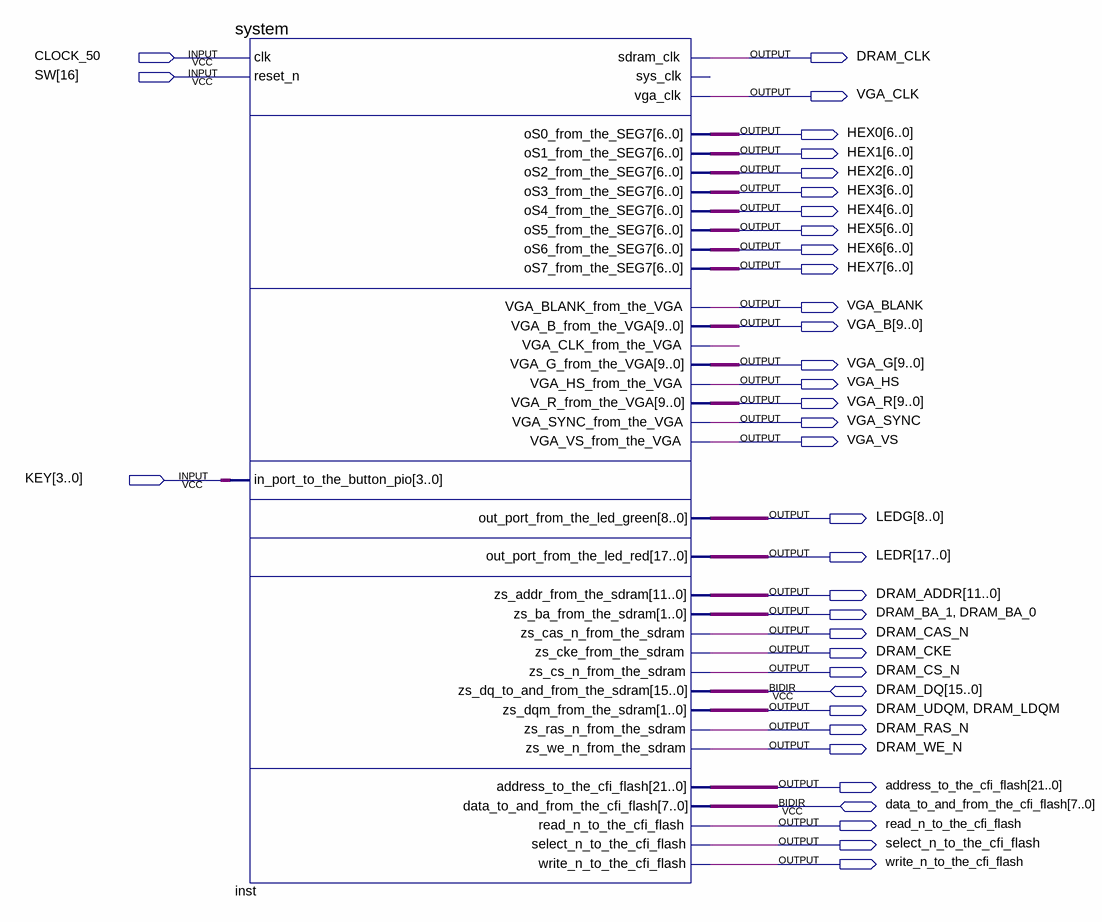
[diagram p0: schematic sheet]
// Quartus schematic example_ref.bdf as structural Verilog: 1 symbols, 36 pins
module example_ref (
  input  CLOCK_50,
  input  [16:16] SW,
  input  [3:0] KEY,
  inout  [15:0] DRAM_DQ,
  inout  [7:0] data_to_and_from_the_cfi_flash,
  output DRAM_CLK,
  output VGA_CLK,
  output [6:0] HEX0,
  output [6:0] HEX1,
  output [6:0] HEX2,
  output [6:0] HEX3,
  output [6:0] HEX4,
  output [6:0] HEX5,
  output [6:0] HEX6,
  output [6:0] HEX7,
  output VGA_BLANK,
  output [9:0] VGA_B,
  output [9:0] VGA_G,
  output VGA_HS,
  output [9:0] VGA_R,
  output VGA_SYNC,
  output VGA_VS,
  output [8:0] LEDG,
  output [17:0] LEDR,
  output [11:0] DRAM_ADDR,
  output DRAM_BA_1,
  output DRAM_BA_0,
  output DRAM_CAS_N,
  output DRAM_CKE,
  output DRAM_CS_N,
  output DRAM_UDQM,
  output DRAM_LDQM,
  output DRAM_RAS_N,
  output DRAM_WE_N,
  output [21:0] address_to_the_cfi_flash,
  output read_n_to_the_cfi_flash,
  output select_n_to_the_cfi_flash,
  output write_n_to_the_cfi_flash
);

  wire inst_vga_clk_from_the_vga;

  system inst (
    .clk(CLOCK_50), .reset_n(SW[16]), .in_port_to_the_button_pio(KEY), .sdram_clk(DRAM_CLK),
    .vga_clk(VGA_CLK), .oS0_from_the_SEG7(HEX0), .oS1_from_the_SEG7(HEX1), .oS2_from_the_SEG7(HEX2),
    .oS3_from_the_SEG7(HEX3), .oS4_from_the_SEG7(HEX4), .oS5_from_the_SEG7(HEX5), .oS6_from_the_SEG7(HEX6),
    .oS7_from_the_SEG7(HEX7), .VGA_BLANK_from_the_VGA(VGA_BLANK), .VGA_B_from_the_VGA(VGA_B),
    .VGA_CLK_from_the_VGA(inst_vga_clk_from_the_vga), .VGA_G_from_the_VGA(VGA_G),
    .VGA_HS_from_the_VGA(VGA_HS), .VGA_R_from_the_VGA(VGA_R), .VGA_SYNC_from_the_VGA(VGA_SYNC),
    .VGA_VS_from_the_VGA(VGA_VS), .out_port_from_the_led_green(LEDG), .out_port_from_the_led_red(LEDR),
    .zs_addr_from_the_sdram(DRAM_ADDR), .zs_ba_from_the_sdram({DRAM_BA_1, DRAM_BA_0}),
    .zs_cas_n_from_the_sdram(DRAM_CAS_N), .zs_cke_from_the_sdram(DRAM_CKE),
    .zs_cs_n_from_the_sdram(DRAM_CS_N), .zs_dqm_from_the_sdram({DRAM_UDQM, DRAM_LDQM}),
    .zs_ras_n_from_the_sdram(DRAM_RAS_N), .zs_we_n_from_the_sdram(DRAM_WE_N),
    .address_to_the_cfi_flash(address_to_the_cfi_flash), .read_n_to_the_cfi_flash(read_n_to_the_cfi_flash),
    .select_n_to_the_cfi_flash(select_n_to_the_cfi_flash),
    .write_n_to_the_cfi_flash(write_n_to_the_cfi_flash), .zs_dq_to_and_from_the_sdram(DRAM_DQ),
    .data_to_and_from_the_cfi_flash(data_to_and_from_the_cfi_flash));  // open: sys_clk
endmodule
